# EAGLE schematic servo_1 (EAGLE 6.5.0)
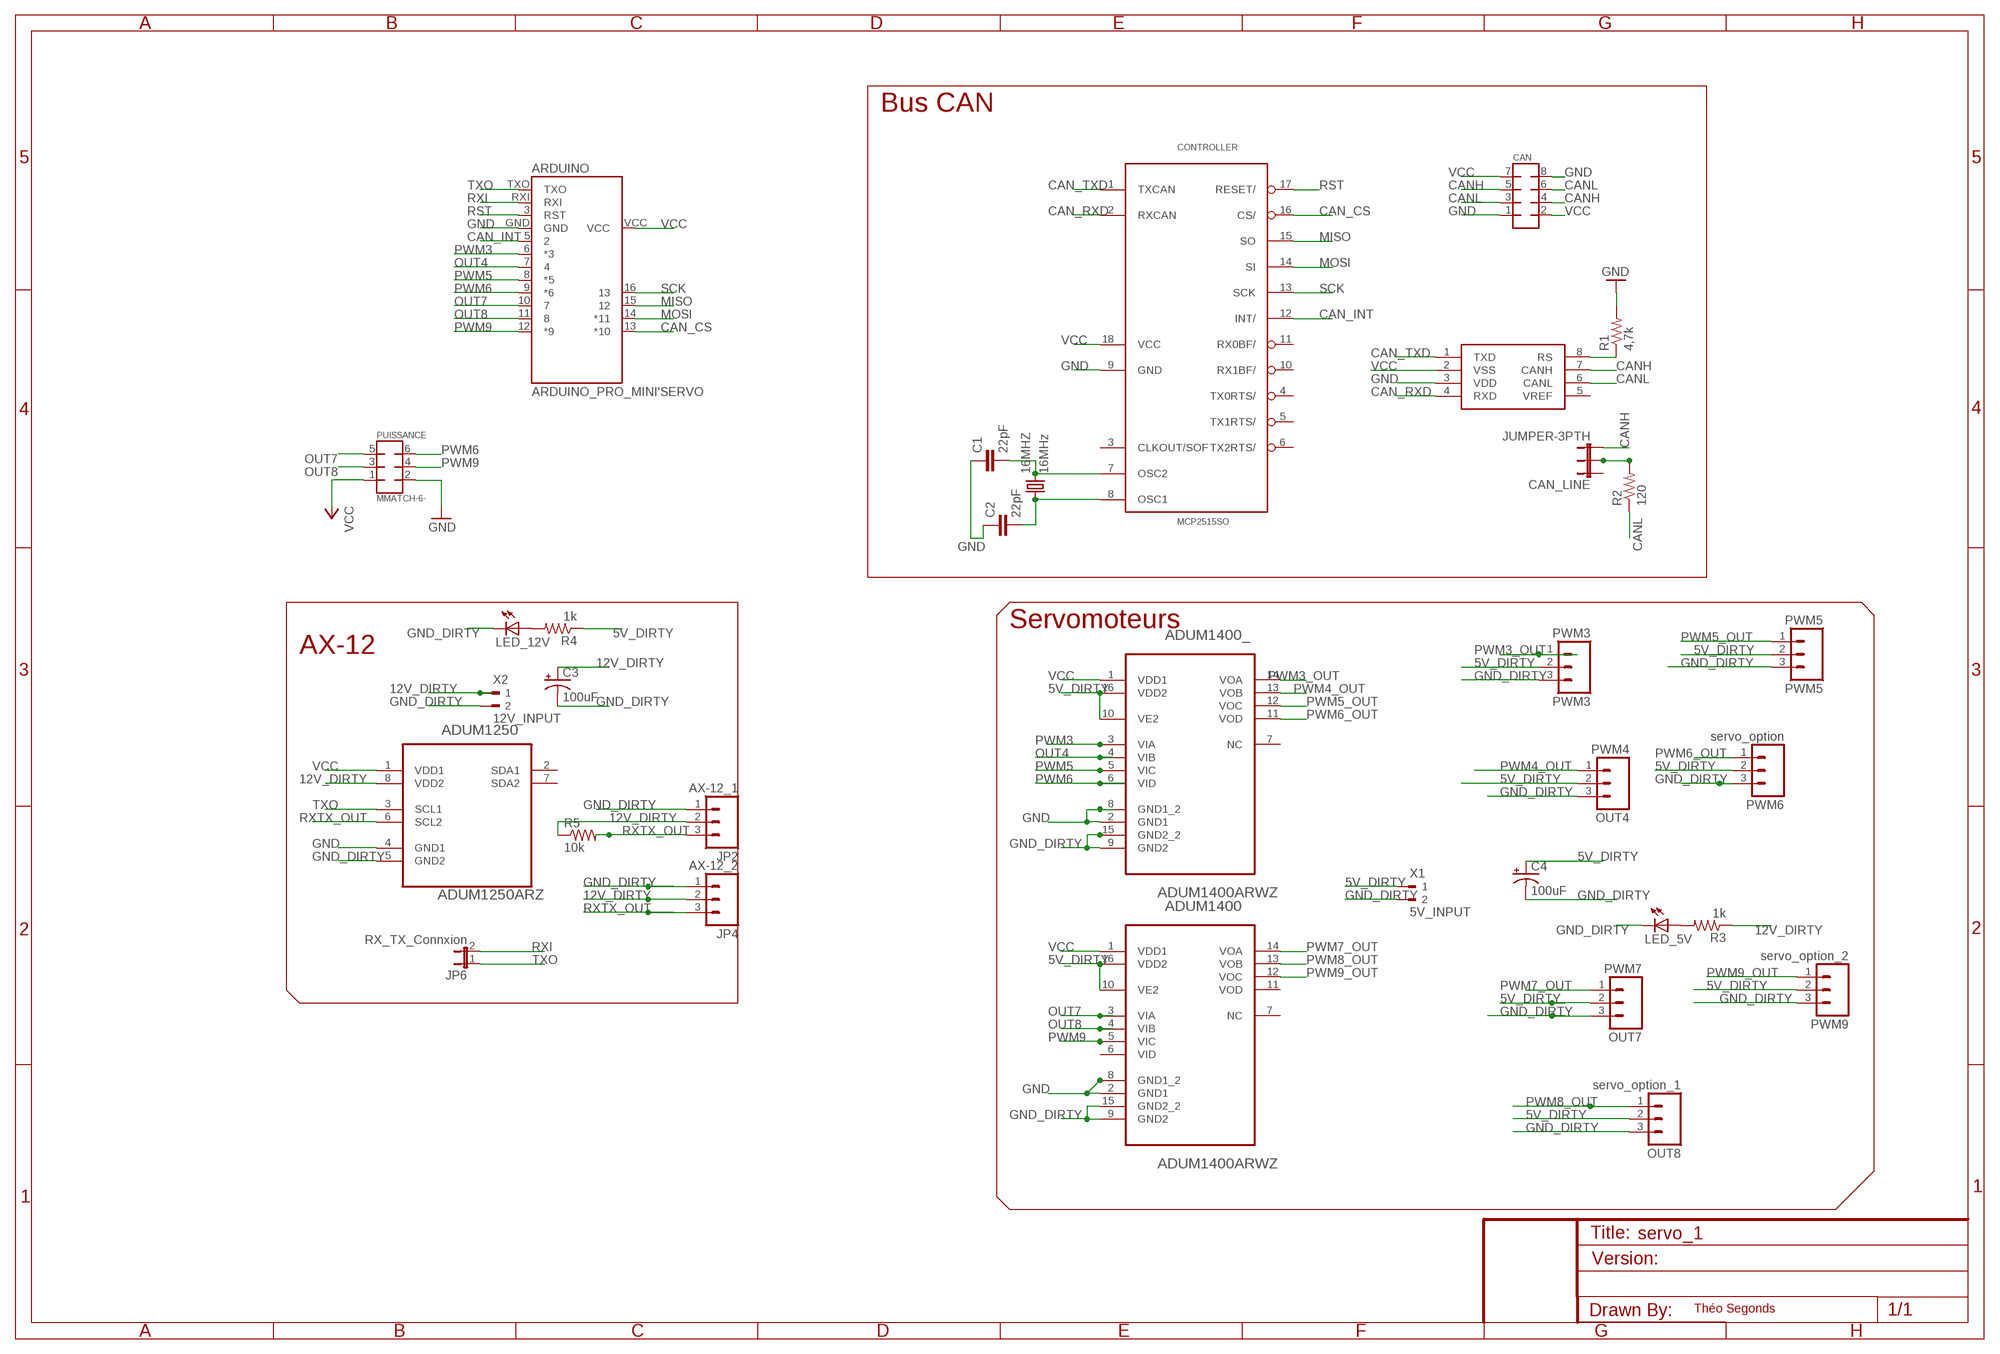
[diagram p0: schematic, sheet 1]

## Parts
16MHZ  16MHz  CRYSTALHC49S  [HC49/S]
ADUM1250  ADUM1250ARZ  [SOIC127P600X175-8N]
ADUM1400  ADUM1400ARWZ  [SOIC127P1032X265-16N]
ADUM1400_  ADUM1400ARWZ  [SOIC127P1032X265-16N]
ARDUINO  ARDUINO_PRO_MINI'SERVO  [ARDUINO_PRO_MINI]
C1  22pF  CAP0805  [0805]
C2  22pF  CAP0805  [0805]
C3  100uF  CAP_POLPTH1  [CPOL-RADIAL-100UF-25V]
C4  100uF  CAP_POLPTH1  [CPOL-RADIAL-100UF-25V]
CAN  MMATCH-8-PTH  [AMP-215079-8]
CAN_LINE  JUMPER-3PTH  [1X03]
CONTROLLER  MCP2515SO  [SO18L]
JP2  AX-12_1  M03POLAR  [MOLEX-1X3]
JP4  AX-12_2  M03POLAR  [MOLEX-1X3]
JP6  RX_TX_Connxion  JUMPER-2PTH  [1X02]
LED_5V  LEDCHIPLED_0805  [CHIPLED_0805]
LED_12V  LEDCHIPLED_0805  [CHIPLED_0805]
OUT4  PWM4  M03PTH  [1X03]
OUT7  PWM7  M03PTH  [1X03]
OUT8  servo_option_1  M03PTH  [1X03]
PUISSANCE  MMATCH-6-  [AMP-215079-6]
PWM3  PWM3  M03PTH  [1X03]
PWM5  PWM5  M03PTH  [1X03]
PWM6  servo_option  M03PTH  [1X03]
PWM9  servo_option_2  M03PTH  [1X03]
R1  4,7k  RESISTOR0805-RES  [0805]
R2  120  RESISTOR0805-RES  [0805]
R3  1k  RESISTOR0805-RES  [0805]
R4  1k  RESISTOR0805-RES  [0805]
R5  10k  RESISTOR0805-RES  [0805]
TRANSCEIVER  MCP2551  [SO08]
X1  5V_INPUT  90-2  [90-2]
X2  12V_INPUT  90-2  [90-2]

## Nets
5V_DIRTY: ADUM1400.10(VE2) ADUM1400.16(VDD2) ADUM1400_.10(VE2) ADUM1400_.16(VDD2) C4.1(+) OUT4.2 OUT7.2 OUT8.2 PWM3.2 PWM5.2 PWM6.2 PWM9.2 R4.1 X1.1
12V_DIRTY: ADUM1250.8(VDD2) C3.1(+) JP2.2 JP4.2 R3.1 R5.1 X2.1
CAN_CS: ARDUINO.13(*10) CONTROLLER.16(CS/)
CAN_INT: ARDUINO.5 CONTROLLER.12(INT/)
CAN_RXD: CONTROLLER.2(RXCAN) TRANSCEIVER.4(RXD)
CAN_TXD: CONTROLLER.1(TXCAN) TRANSCEIVER.1(TXD)
CANH: CAN.4 CAN.5 CAN_LINE.3 TRANSCEIVER.7(CANH)
CANL: CAN.3 CAN.6 R2.1 TRANSCEIVER.6(CANL)
GND: ADUM1250.4(GND1) ADUM1400.2(GND1) ADUM1400.8(GND1_2) ADUM1400_.2(GND1) ADUM1400_.8(GND1_2) ARDUINO.GND C1.1 C2.1 CAN.1 CAN.8 CONTROLLER.9(GND) PUISSANCE.2 R1.2 TRANSCEIVER.3(VDD)
GND_DIRTY: ADUM1250.5(GND2) ADUM1400.9(GND2) ADUM1400.15(GND2_2) ADUM1400_.9(GND2) ADUM1400_.15(GND2_2) C3.2(-) C4.2(-) JP2.1 JP4.1 LED_5V.C LED_12V.C OUT4.3 OUT7.3 OUT8.3 PWM3.3 PWM5.3 PWM6.3 PWM9.3 X1.2 X2.2
MISO: ARDUINO.15 CONTROLLER.15(SO)
MOSI: ARDUINO.14(*11) CONTROLLER.14(SI)
N$2: 16MHZ.2 C1.2 CONTROLLER.7(OSC2)
N$3: 16MHZ.1 C2.2 CONTROLLER.8(OSC1)
N$4: LED_5V.A R3.2
N$5: R1.1 TRANSCEIVER.8(RS)
N$6: LED_12V.A R4.2
N$7: CAN_LINE.2 R2.2
OUT4: ADUM1400_.4(VIB) ARDUINO.7
OUT7: ADUM1400.3(VIA) ARDUINO.10 PUISSANCE.5
OUT8: ADUM1400.4(VIB) ARDUINO.11 PUISSANCE.3
PWM3: ADUM1400_.3(VIA) ARDUINO.6(*3)
PWM3_OUT: ADUM1400_.14(VOA) PWM3.1
PWM4_OUT: ADUM1400_.13(VOB) OUT4.1
PWM5: ADUM1400_.5(VIC) ARDUINO.8(*5)
PWM5_OUT: ADUM1400_.12(VOC) PWM5.1
PWM6: ADUM1400_.6(VID) ARDUINO.9(*6) PUISSANCE.6
PWM6_OUT: ADUM1400_.11(VOD) PWM6.1
PWM7_OUT: ADUM1400.14(VOA) OUT7.1
PWM8_OUT: ADUM1400.13(VOB) OUT8.1
PWM9: ADUM1400.5(VIC) ARDUINO.12(*9) PUISSANCE.4
PWM9_OUT: ADUM1400.12(VOC) PWM9.1
RST: ARDUINO.3(RST) CONTROLLER.17(RESET/)
RXI: ARDUINO.RXI JP6.2
RXTX_OUT: ADUM1250.6(SCL2) JP2.3 JP4.3 R5.2
SCK: ARDUINO.16 CONTROLLER.13(SCK)
TXO: ADUM1250.3(SCL1) ARDUINO.TXO JP6.1
VCC: ADUM1250.1(VDD1) ADUM1400.1(VDD1) ADUM1400_.1(VDD1) ARDUINO.VCC CAN.2 CAN.7 CONTROLLER.18(VCC) PUISSANCE.1 TRANSCEIVER.2(VSS)
Unconnected: ADUM1250.2(SDA1) ADUM1250.7(SDA2) ADUM1400.6(VID) ADUM1400.7(NC) ADUM1400.11(VOD) ADUM1400_.7(NC) CAN_LINE.1 CONTROLLER.3(CLKOUT/SOF) CONTROLLER.4(TX0RTS/) CONTROLLER.5(TX1RTS/) CONTROLLER.6(TX2RTS/) CONTROLLER.10(RX1BF/) CONTROLLER.11(RX0BF/) TRANSCEIVER.5(VREF)

## Notes on the sheet
- Bus CAN
- Servomoteurs
- AX-12
- Théo Segonds

## Library data of the parts
16MHZ = adafruit:CRYSTAL: CRYSTAL; MF: MULTICOMP; MPN: HC49SM-3.6864-30-50-60-16-ATF; OC_FARNELL: 1667008; OC_NEWARK: unknown
ADUM1250 = Analog Devices_By_element14_Batch_1:ADUM1250ARZ: Hot Swappable, Dual I2C Isolators; MF: ANALOG DEVICES; MPN: ADUM1250ARZ; OC_FARNELL: 1814353; OC_NEWARK: 27M9880; PACKAGE: SOIC-8; SUPPLIER: Analog Devices
ADUM1400 ADUM1400_ = Analog Devices_By_element14_Batch_1:ADUM1400ARWZ: Quad-Channel Digital Isolators; MF: ANALOG DEVICES; MPN: ADUM1400ARWZ; OC_FARNELL: 1226217; OC_NEWARK: 19M8755; PACKAGE: SOIC-16; SUPPLIER: Analog Devices
ARDUINO = can_bus_servo:ARDUINO_PRO_MINI; OC_FARNELL: unknown
C1 C2 = SparkFun-Capacitors:CAP: Capacitor Standard 0603 ceramic capacitor, and 0.1" leaded capacitor.; MF: AVX; MPN: 08055A220JAT2A; OC_FARNELL: 2280675RL
C3 C4 = SparkFun-Capacitors:CAP_POL: Capacitor Polarized These are standard SMD and PTH capacitors. Normally 10uF, 47uF, and 100uF in electrolytic and tantalum varieties. Always verify the external diameter of the through hole cap, it varies with capacity, voltage, and manufacturer. The EIA devices should be standard.; MF: RUBYCON; MPN: 100TXW100MEFC8X30; OC_FARNELL: 2346289
CAN = jt-con-micromatch:MMATCH-8-*: AMP Micromatch 8-pin; OC_FARNELL: unknown
CAN_LINE = SparkFun-Passives:JUMPER-3
CONTROLLER = MCP2515_MT:MCP2515*: MCP2515 Standalone CAN-Controller by Microchip Eagle-Lib. by MartinThomas; OC_FARNELL: unknown
JP2 JP4 OUT4 OUT7 OUT8 PWM3 PWM5 PWM6 PWM9 = SparkFun-Connectors:M03: Header 3 Standard 3-pin 0.1" header. Use with straight break away headers (SKU : PRT-00116), right angle break away headers (PRT-00553), swiss pins (PRT-00743), machine pins (PRT-00117), and female headers (PRT-00115). Molex polarized connector foot print use with SKU : PRT-08232 with associated crimp pins and housings.; OC_FARNELL: unknown
JP6 = SparkFun-Passives:JUMPER-2: Jumper Basic 0.1" spaced jumper. Use with breakaway headers.; OC_FARNELL: unknown
LED_5V LED_12V = adafruit:LED: LED OSRAM: - CHIPLED LG R971, LG N971, LY N971, LG Q971, LY Q971, LO R971, LY R971 LH N974, LH R974 LS Q976, LO Q976, LY Q976 LO Q996 - Hyper CHIPLED LW Q18S LB Q993, LB Q99A, LB R99A - SideLED LS A670, LO A670, LY A670, LG A670, LP A670 LB A673, LV A673, LT A673, LW A673 LH A674 LY A675 LS A676, LA A676, LO A676, LY A676, LW A676 LS A679, LY A679, LG A679 - Hyper Micro SIDELED® LS Y876, LA Y876, LO Y876, LY Y876 LT Y87S - SmartLED LW L88C, LW L88S LB L89C, LB L89S, LG L890 LS L89K, LO L89K, LY L89K LS L896, LA L896, LO L896, LY L896 - TOPLED LS T670, LO T670, LY T670, LG T670, LP T670 LSG T670, LSP T670, LSY T670, LOP T670, LYG T670 LG T671, LOG T671, LSG T671 LB T673, LV T673, LT T673, LW T673 LH T674 LS T676, LA T676, LO T676, LY T676, LB T676, LH T676, LSB T676, LW T676 LB T67C, LV T67C, LT T67C, LS T67K, LO T67K, LY T67K, LW E67C LS E67B, LA E67B, LO E67B, LY E67B, LB E67C, LV E67C, LT E67C LW T67C LS T679, LY T679, LG T679 LS T770, LO T770, LY T770, LG T770, LP T770 LB T773, LV T773, LT T773, LW T773 LH T774 LS E675, LA E675, LY E675, LS T675 LS T776, LA T776, LO T776, LY T776, LB T776 LHGB T686 LT T68C, LB T68C - Hyper Mini TOPLED® LB M676 - Mini TOPLED Santana® LG M470 LS M47K, LO M47K, LY M47K Source: http://www.osram.convergy.de/
PUISSANCE = jt-con-micromatch:MMATCH-6-*
R1-R5 = SparkFun-Passives:RESISTOR: Resistor Basic schematic elements and footprints for 0603, 1206, and PTH resistors.; OC_FARNELL: unknown
TRANSCEIVER = SparkFun-DigitalIC:MCP2551: CAN transceiver; MF: MICROCHIP; MPN: MCP2551-I/SN...; OC_FARNELL: 2119745
X1 X2 = con-weidmueller-sl35:90-2: WEIDMUELLER CLAMP CONNECTOR; OC_FARNELL: unknown; OC_NEWARK: unknown

## Net classes
0 default: clearance 0.205 mm